# Altium schematic sheet TitleBlock.SchDoc: Title Block
size 381 x 243 mm; Date: 12/1/24; SheetNumber: 1; SheetTotal: 2

## Parts
?  (no value)

## Notes on the sheet
- Drawn By:
- Date Created:
- Last Updated:
- Checked By:
- Revision
- Sheet #
- of

## Library data of the parts
? = Title Block